# EAGLE schematic circuito (EAGLE 9.6.2)
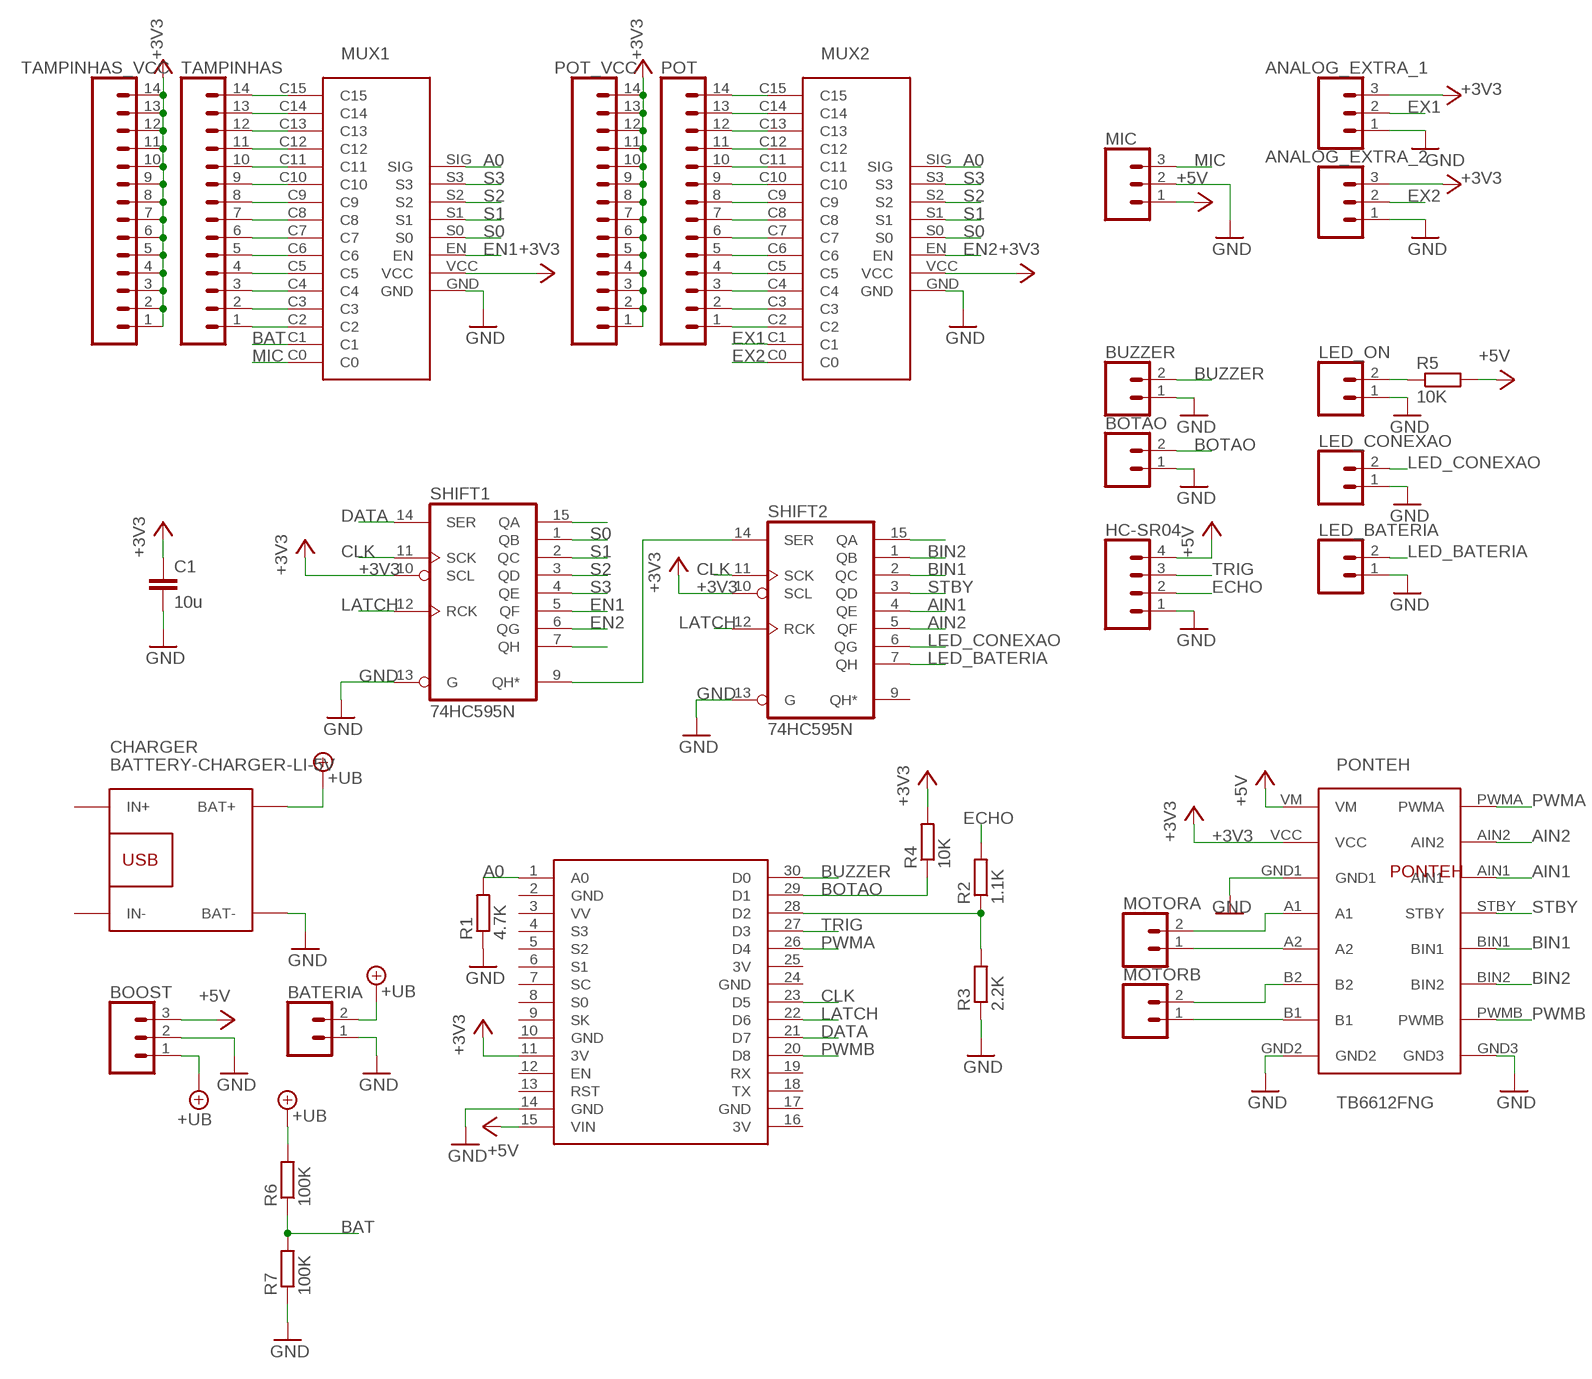
[diagram p0: schematic, sheet 1]

## Parts
ANALOG_EXTRA_1  CONN_03  [1X03]
ANALOG_EXTRA_2  CONN_03  [1X03]
BATERIA  CONN_02  [1X02]
BOOST  CONN_03  [1X03]
BOTAO  CONN_02  [1X02]
BUZZER  CONN_02  [1X02]
C1  10u  C2,5-3  [C2.5-3]
CHARGER  BATTERY-CHARGER-LI-5V  [BATTERY-CHARGER-LI-5V]
HC-SR04  CONN_04  [1X04]
LED_BATERIA  CONN_02  [1X02]
LED_CONEXAO  CONN_02  [1X02]
LED_ON  CONN_02  [1X02]
MIC  CONN_03  [1X03]
MOTORA  CONN_02  [1X02]
MOTORB  CONN_02  [1X02]
MUX1  4067_MODULE  [4067_MODULE]
MUX2  4067_MODULE  [4067_MODULE]
NODEMCU  NODEMCU  [NODEMCU]
PONTEH  TB6612FNG  [TB6612FNG]
POT  CONN_14  [1X14]
POT_VCC  CONN_14  [1X14]
R1  4.7K  R-EU_0204/7  [0204/7]
R2  1.1K  R-EU_0204/7  [0204/7]
R3  2.2K  R-EU_0204/7  [0204/7]
R4  10K  R-EU_0204/7  [0204/7]
R5  10K  R-EU_0204/7  [0204/7]
R6  100K  R-EU_0204/7  [0204/7]
R7  100K  R-EU_0204/7  [0204/7]
SHIFT1  74HC595N  [DIL16]
SHIFT2  74HC595N  [DIL16]
TAMPINHAS  CONN_14  [1X14]
TAMPINHAS_VCC  CONN_14  [1X14]

## Nets
+3V3: ANALOG_EXTRA_1.3 ANALOG_EXTRA_2.3 C1.1 MUX1.VCC MUX2.VCC NODEMCU.11(3V) PONTEH.VCC POT_VCC.1 POT_VCC.2 POT_VCC.3 POT_VCC.4 POT_VCC.5 POT_VCC.6 POT_VCC.7 POT_VCC.8 POT_VCC.9 POT_VCC.10 POT_VCC.11 POT_VCC.12 POT_VCC.13 POT_VCC.14 R4.2 SHIFT1.10(SCL) SHIFT2.10(SCL) TAMPINHAS_VCC.1 TAMPINHAS_VCC.2 TAMPINHAS_VCC.3 TAMPINHAS_VCC.4 TAMPINHAS_VCC.5 TAMPINHAS_VCC.6 TAMPINHAS_VCC.7 TAMPINHAS_VCC.8 TAMPINHAS_VCC.9 TAMPINHAS_VCC.10 TAMPINHAS_VCC.11 TAMPINHAS_VCC.12 TAMPINHAS_VCC.13 TAMPINHAS_VCC.14
+5V: BOOST.3 HC-SR04.4 MIC.1 NODEMCU.15(VIN) PONTEH.VM R5.2
+UB: BATERIA.2 BOOST.1 CHARGER.BAT+ R6.2
A0: MUX1.SIG MUX2.SIG NODEMCU.1(A0) R1.2
AIN1: PONTEH.AIN1 SHIFT2.4(QE)
AIN2: PONTEH.AIN2 SHIFT2.5(QF)
BAT: MUX1.C1 R6.1 R7.2
BIN1: PONTEH.BIN1 SHIFT2.2(QC)
BIN2: PONTEH.BIN2 SHIFT2.1(QB)
BOTAO: BOTAO.2 NODEMCU.29(D1) R4.1
BUZZER: BUZZER.2 NODEMCU.30(D0)
CLK: NODEMCU.23(D5) SHIFT1.11(SCK) SHIFT2.11(SCK)
DATA: NODEMCU.21(D7) SHIFT1.14(SER)
ECHO: HC-SR04.2 R2.2
EN1: MUX1.EN SHIFT1.5(QF)
EN2: MUX2.EN SHIFT1.6(QG)
EX1: ANALOG_EXTRA_1.2 MUX2.C1
EX2: ANALOG_EXTRA_2.2 MUX2.C0
GND: ANALOG_EXTRA_1.1 ANALOG_EXTRA_2.1 BATERIA.1 BOOST.2 BOTAO.1 BUZZER.1 C1.2 CHARGER.BAT- HC-SR04.1 LED_BATERIA.1 LED_CONEXAO.1 LED_ON.1 MIC.2 MUX1.GND MUX2.GND NODEMCU.14(GND) PONTEH.GND1 PONTEH.GND2 PONTEH.GND3 R1.1 R3.1 R7.1 SHIFT1.13(G) SHIFT2.13(G)
LATCH: NODEMCU.22(D6) SHIFT1.12(RCK) SHIFT2.12(RCK)
LED_BATERIA: LED_BATERIA.2 SHIFT2.7(QH)
LED_CONEXAO: LED_CONEXAO.2 SHIFT2.6(QG)
MIC: MIC.3 MUX1.C0
N$1: MOTORA.2 PONTEH.A1
N$2: MOTORA.1 PONTEH.A2
N$3: MOTORB.2 PONTEH.B2
N$4: MOTORB.1 PONTEH.B1
N$5: SHIFT1.9(QH*) SHIFT2.14(SER)
N$8: MUX2.C2 POT.1
N$9: MUX2.C3 POT.2
N$10: MUX2.C4 POT.3
N$11: MUX2.C5 POT.4
N$12: MUX2.C6 POT.5
N$13: MUX2.C7 POT.6
N$14: MUX2.C8 POT.7
N$15: MUX2.C9 POT.8
N$16: MUX2.C10 POT.9
N$17: MUX2.C11 POT.10
N$18: MUX2.C12 POT.11
N$19: MUX2.C13 POT.12
N$20: MUX2.C14 POT.13
N$21: MUX2.C15 POT.14
N$24: MUX1.C2 TAMPINHAS.1
N$25: MUX1.C3 TAMPINHAS.2
N$26: MUX1.C4 TAMPINHAS.3
N$27: MUX1.C5 TAMPINHAS.4
N$28: MUX1.C6 TAMPINHAS.5
N$29: MUX1.C7 TAMPINHAS.6
N$30: MUX1.C8 TAMPINHAS.7
N$31: MUX1.C9 TAMPINHAS.8
N$32: MUX1.C10 TAMPINHAS.9
N$33: MUX1.C11 TAMPINHAS.10
N$34: MUX1.C12 TAMPINHAS.11
N$35: MUX1.C13 TAMPINHAS.12
N$36: MUX1.C14 TAMPINHAS.13
N$37: MUX1.C15 TAMPINHAS.14
N$38: SHIFT1.15(QA)
N$39: NODEMCU.28(D2) R2.1 R3.2
N$40: LED_ON.2 R5.1
N$46: SHIFT1.7(QH)
N$47: SHIFT2.15(QA)
PWMA: NODEMCU.26(D4) PONTEH.PWMA
PWMB: NODEMCU.20(D8) PONTEH.PWMB
S0: MUX1.S0 MUX2.S0 SHIFT1.1(QB)
S1: MUX1.S1 MUX2.S1 SHIFT1.2(QC)
S2: MUX1.S2 MUX2.S2 SHIFT1.3(QD)
S3: MUX1.S3 MUX2.S3 SHIFT1.4(QE)
STBY: PONTEH.STBY SHIFT2.3(QD)
TRIG: HC-SR04.3 NODEMCU.27(D3)
Unconnected: CHARGER.IN+ CHARGER.IN- NODEMCU.3(VV) NODEMCU.4(S3) NODEMCU.5(S2) NODEMCU.6(S1) NODEMCU.7(SC) NODEMCU.8(S0) NODEMCU.9(SK) NODEMCU.12(EN) NODEMCU.13(RST) NODEMCU.18(TX) NODEMCU.19(RX) SHIFT2.9(QH*)

## Power pins joined to a net without a drawn wire
3V: NODEMCU.16(3V) NODEMCU.25(3V)
GND: NODEMCU.2(GND) NODEMCU.10(GND) NODEMCU.17(GND) NODEMCU.24(GND) SHIFT1.8(GND) SHIFT2.8(GND)
VCC: SHIFT1.16(VCC) SHIFT2.16(VCC)

## Library data of the parts
ANALOG_EXTRA_1 ANALOG_EXTRA_2 BOOST MIC = SparkFun-Connectors:CONN_03: Multi connection point. Often used as Generic Header-pin footprint for 0.1 inch spaced/style header connections On any of the 0.1 inch spaced packages, you can populate with these: Break Away Headers - Straight <https://www.sparkfun.com/products/116> (PRT-00116) Break Away Male Headers - Right Angle <https://www.sparkfun.com/products/553> (PRT-00553) Female Headers <https://www.sparkfun.com/products/115> (PRT-00115) Break Away Headers - Machine Pin <https://www.sparkfun.com/products/117> (PRT-00117) Break Away Female Headers - Swiss Machine Pin <https://www.sparkfun.com/products/743> (PRT-00743) Stackable Header - 3 Pin (Female, 0.1") <https://www.sparkfun.com/products/13875> (PRT-13875) For SCREWTERMINALS and SPRING TERMINALS visit here: Screw Terimnals on SparkFun.com <https://www.sparkfun.com/search/results?term=Screw+Terminals> (5mm/3.5mm/2.54mm spacing) This device is also useful as a general connection point to wire up your design to another part of your project. Our various solder wires solder well into these plated through hole pads. Hook-Up Wire - Assortment (Stranded, 22 AWG) <https://www.sparkfun.com/products/11375> (PRT-11375) Hook-Up Wire - Assortment (Solid Core, 22 AWG) <https://www.sparkfun.com/products/11367> (PRT-11367) View the entire wire category on our website here <https://www.sparkfun.com/categories/141> Special notes: Molex polarized connector foot print use with SKU : PRT-08232 with associated crimp pins and housings.
BATERIA BOTAO BUZZER LED_BATERIA LED_CONEXAO LED_ON MOTORA MOTORB = SparkFun-Connectors:CONN_02: Multi connection point. Often used as Generic Header-pin footprint for 0.1 inch spaced/style header connections On any of the 0.1 inch spaced packages, you can populate with these: Break Away Headers - Straight <https://www.sparkfun.com/products/116> (PRT-00116) Break Away Male Headers - Right Angle <https://www.sparkfun.com/products/553> (PRT-00553) Female Headers <https://www.sparkfun.com/products/115> (PRT-00115) Break Away Headers - Machine Pin <https://www.sparkfun.com/products/117> (PRT-00117) Break Away Female Headers - Swiss Machine Pin <https://www.sparkfun.com/products/743> (PRT-00743) For SCREWTERMINALS and SPRING TERMINALS visit here: Screw Terimnals on SparkFun.com <https://www.sparkfun.com/search/results?term=Screw+Terminals> (5mm/3.5mm/2.54mm spacing) This device is also useful as a general connection point to wire up your design to another part of your project. Our various solder wires solder well into these plated through hole pads. Hook-Up Wire - Assortment (Stranded, 22 AWG) <https://www.sparkfun.com/products/11375> (PRT-11375) Hook-Up Wire - Assortment (Solid Core, 22 AWG) <https://www.sparkfun.com/products/11367> (PRT-11367) View the entire wire category on our website here <https://www.sparkfun.com/categories/141> Special notes: Molex polarized connector foot print use with: PRT-08233 with associated crimp pins and housings. 2.54_SCREWTERM for use with PRT-10571. 3.5mm Screw Terminal footprints for PRT-08084 5mm Screw Terminal footprints for use with PRT-08432
C1 = capacitor-wima:C: CAPACITOR naming: grid - package width
CHARGER = diy-modules:BATTERY-CHARGER-LI-5V: Lithium Battery 5V Charger More details available here: http://www.buildcircuit.com/how-to-use-micro-usb-5v-1a-lithium-battery-charging-board-charger-module/ Click here to find device on ebay.com <http://www.ebay.com/sch/tp4056+charger+usb>
HC-SR04 = SparkFun-Connectors:CONN_04: Multi connection point. Often used as Generic Header-pin footprint for 0.1 inch spaced/style header connections On any of the 0.1 inch spaced packages, you can populate with these: Break Away Headers - Straight <https://www.sparkfun.com/products/116> (PRT-00116) Break Away Male Headers - Right Angle <https://www.sparkfun.com/products/553> (PRT-00553) Female Headers <https://www.sparkfun.com/products/115> (PRT-00115) Break Away Headers - Machine Pin <https://www.sparkfun.com/products/117> (PRT-00117) Break Away Female Headers - Swiss Machine Pin <https://www.sparkfun.com/products/743> (PRT-00743) For SCREWTERMINALS and SPRING TERMINALS visit here: Screw Terimnals on SparkFun.com <https://www.sparkfun.com/search/results?term=Screw+Terminals> (5mm/3.5mm/2.54mm spacing) This device is also useful as a general connection point to wire up your design to another part of your project. Our various solder wires solder well into these plated through hole pads. Hook-Up Wire - Assortment (Stranded, 22 AWG) <https://www.sparkfun.com/products/11375> (PRT-11375) Hook-Up Wire - Assortment (Solid Core, 22 AWG) <https://www.sparkfun.com/products/11367> (PRT-11367) View the entire wire category on our website here <https://www.sparkfun.com/categories/141> Special notes: Molex polarized connector foot print use with SKU : PRT-08231 with associated crimp pins and housings. 1MM SMD Version SKU: PRT-10208; PROD_ID: CONN-09696
MUX1 MUX2 = personal:4067_MODULE
NODEMCU = nodemcu:NODEMCU
PONTEH = TB6612FNG:TB6612FNG
POT POT_VCC TAMPINHAS TAMPINHAS_VCC = SparkFun-Connectors:CONN_14: Multi connection point. Often used as Generic Header-pin footprint for 0.1 inch spaced/style header connections On any of the 0.1 inch spaced packages, you can populate with these: Break Away Headers - Straight <https://www.sparkfun.com/products/116> (PRT-00116) Break Away Male Headers - Right Angle <https://www.sparkfun.com/products/553> (PRT-00553) Female Headers <https://www.sparkfun.com/products/115> (PRT-00115) Break Away Headers - Machine Pin <https://www.sparkfun.com/products/117> (PRT-00117) Break Away Female Headers - Swiss Machine Pin <https://www.sparkfun.com/products/743> (PRT-00743) For SCREWTERMINALS and SPRING TERMINALS visit here: Screw Terimnals on SparkFun.com <https://www.sparkfun.com/search/results?term=Screw+Terminals> (5mm/3.5mm/2.54mm spacing) This device is also useful as a general connection point to wire up your design to another part of your project. Our various solder wires solder well into these plated through hole pads. Hook-Up Wire - Assortment (Stranded, 22 AWG) <https://www.sparkfun.com/products/11375> (PRT-11375) Hook-Up Wire - Assortment (Solid Core, 22 AWG) <https://www.sparkfun.com/products/11367> (PRT-11367) View the entire wire category on our website here <https://www.sparkfun.com/categories/141> Special notes: Molex polarized connector foot print use with SKU : PRT-08231 with associated crimp pins and housings. 1MM SMD Version SKU: PRT-10208 NOTES ON THE VARIANTS LOCK and LOCK_LONGPADS... This footprint was designed to help hold the alignment of a through-hole component (i.e. 6-pin header) while soldering it into place. You may notice that each hole has been shifted either up or down by 0.005 of an inch from it's more standard position (which is a perfectly straight line). This slight alteration caused the pins (the squares in the middle) to touch the edges of the holes. Because they are alternating, it causes a "brace" to hold the component in place. 0.005 has proven to be the perfect amount of "off-center" position when using our standard breakaway headers. Although looks a little odd when you look at the bare footprint, once you have a header in there, the alteration is very hard to notice. Also,if you push a header all the way into place, it is covered up entirely on the bottom side.
R1-R7 = rcl:R-EU_: RESISTOR, European symbol; SPICEPREFIX: R
SHIFT1 SHIFT2 = 74xx-eu:74*595: 8-bit SHIFT REGISTER, output latch